# Altium schematic sheet STM32F407ZET6_Core.SchDoc
size A3; SheetNumber: 2; SheetTotal: 4
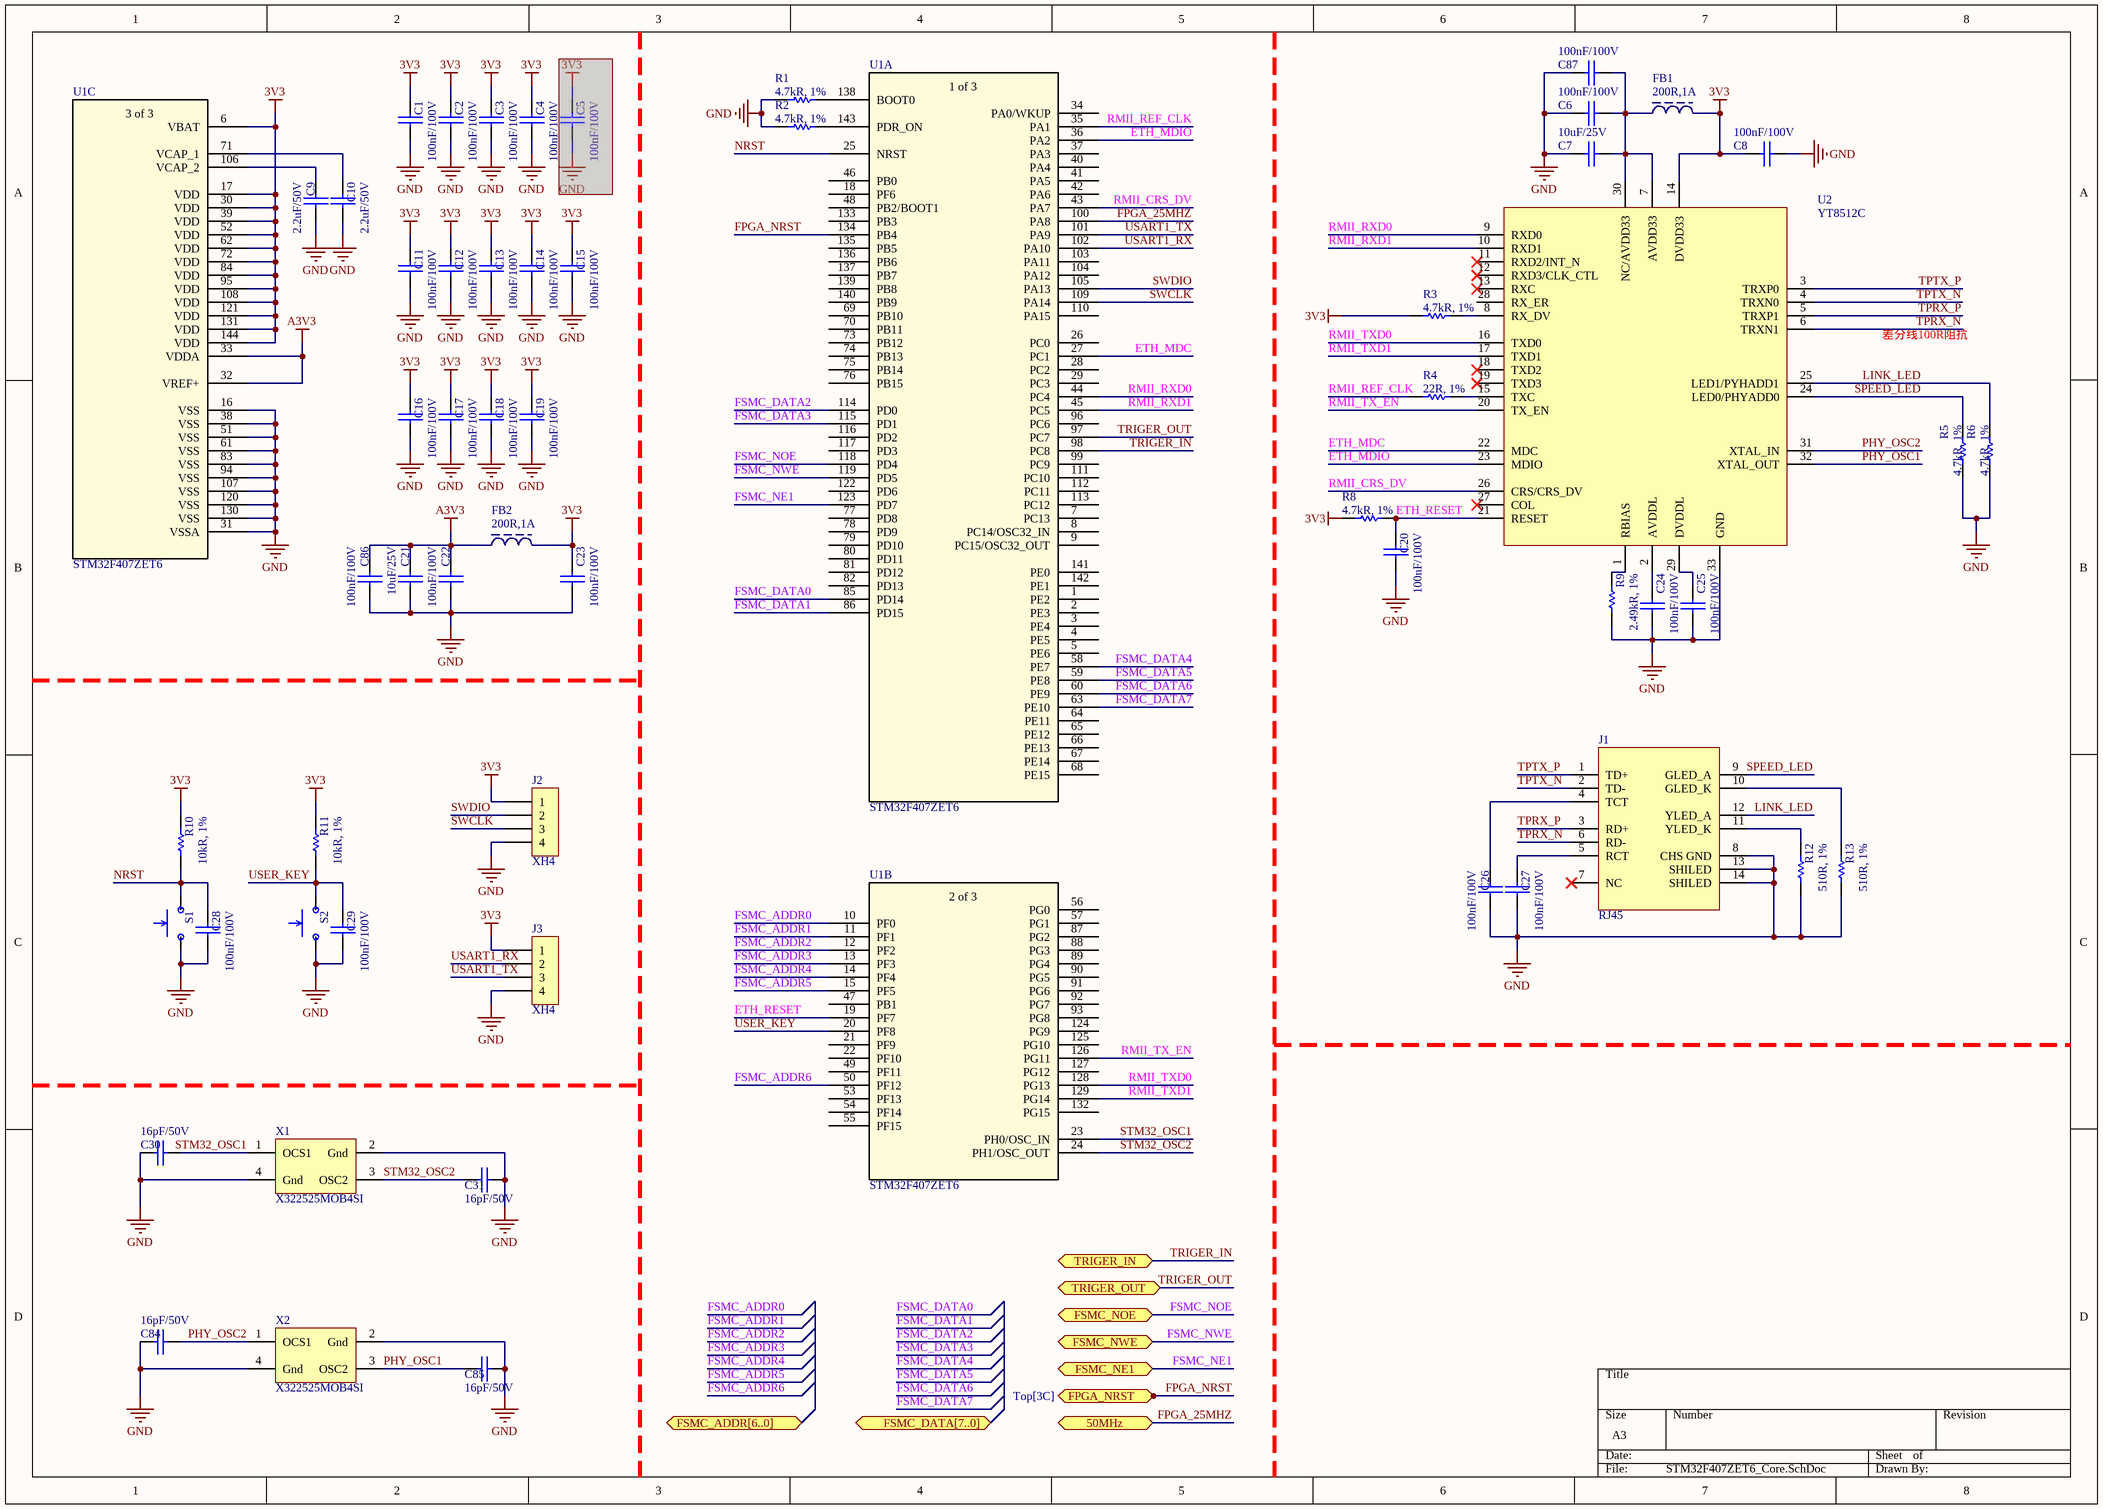
[diagram p0: STM32F407ZET6_Core.SchDoc]

## Parts
C1  100nF/100V  [0603C]
C2  100nF/100V  [0603C]
C3  100nF/100V  [0603C]
C4  100nF/100V  [0603C]
C5  100nF/100V  [0603C]  (masked out: inside a compile mask, not in the netlist)
C6  100nF/100V  [0603C]
C7  10uF/25V  [0603C]
C8  100nF/100V  [0603C]
C9  2.2uF/50V  [0603C]
C10  2.2uF/50V  [0603C]
C11  100nF/100V  [0603C]
C12  100nF/100V  [0603C]
C13  100nF/100V  [0603C]
C14  100nF/100V  [0603C]
C15  100nF/100V  [0603C]
C16  100nF/100V  [0603C]
C17  100nF/100V  [0603C]
C18  100nF/100V  [0603C]
C19  100nF/100V  [0603C]
C20  100nF/100V  [0603C]
C21  10uF/25V  [0603C]
C22  100nF/100V  [0603C]
C23  100nF/100V  [0603C]
C24  100nF/100V  [0603C]
C25  100nF/100V  [0603C]
C26  100nF/100V  [0603C]
C27  100nF/100V  [0603C]
C28  100nF/100V  [0603C]
C29  100nF/100V  [0603C]
C30  16pF/50V  [0603C]
C31  16pF/50V  [0603C]
C84  16pF/50V  [0603C]
C85  16pF/50V  [0603C]
C86  100nF/100V  [0603C]
C87  100nF/100V  [0603C]
FB1  200R,1A  [0603]
FB2  200R,1A  [0603]
J1  RJ45  [1105A_HAN]
J2  XH4  [XH4/2.54mm/180]
J3  XH4  [XH4/2.54mm/180]
R1  4.7kR, 1%  [0603R]
R2  4.7kR, 1%  [0603R]
R3  4.7kR, 1%  [0603R]
R4  22R, 1%  [0603R]
R5  4.7kR, 1%  [0603R]
R6  4.7kR, 1%  [0603R]
R8  4.7kR, 1%  [0603R]
R9  2.49kR, 1%  [0603R]
R10  10kR, 1%  [0603R]
R11  10kR, 1%  [0603R]
R12  510R, 1%  [0603R]
R13  510R, 1%  [0603R]
S1  Key  [SW-SMD]  (value not drawn)
S2  Key  [SW-SMD]  (value not drawn)
U1  STM32F407ZET6  [LQFP144-20x20mm]  (parts A,B,C of 3)
U2  YT8512C  [QFN32]
X1  X322525MOB4SI  [SMD3225-4]
X2  X322525MOB4SI  [SMD3225-4]

## Ports
50MHz (bidir, see Top[3C]), FPGA_NRST (bidir, see Top[3C]), FSMC_ADDR[6..0] (bidir, see Top[3B]), FSMC_DATA[7..0] (bidir, see Top[3B]), FSMC_NE1 (bidir, see Top[3B]), FSMC_NOE (bidir, see Top[3B]), FSMC_NWE (bidir, see Top[3B]), TRIGER_IN (bidir, see Top[3C], EP4CE10F17C8N_Core[6A]), TRIGER_OUT (bidir, see Top[3C], EP4CE10F17C8N_Core[6A])

## Nets
3V3: C1.2 C2.2 C3.2 C4.2 C8.2 C11.2 C12.2 C13.2 C14.2 C15.2 C16.2 C17.2 C18.2 C19.2 C23.2 FB1.2 FB2.2 J2.1 J3.1 R3.1 R8.1 R10.1 R11.1 U1.6(VBAT) U1.17(VDD) U1.30(VDD) U1.39(VDD) U1.52(VDD) U1.62(VDD) U1.72(VDD) U1.84(VDD) U1.95(VDD) U1.108(VDD) U1.121(VDD) U1.131(VDD) U1.144(VDD) U2.14(DVDD33)
A3V3: C21.1 C22.2 C86.2 FB2.1 U1.32(VREF+) U1.33(VDDA)
GND: C1.1 C2.1 C3.1 C4.1 C6.2 C7.2 C8.1 C9.2 C10.2 C11.1 C12.1 C13.1 C14.1 C15.1 C16.1 C17.1 C18.1 C19.1 C20.2 C21.2 C22.1 C23.1 C24.2 C25.2 C26.1 C27.2 C28.1 C29.1 C30.1 C31.2 C84.1 C85.2 C86.1 C87.2 J1.8(CHS_GND) J1.13(SHILED) J1.14(SHILED) J2.4 J3.4 R1.1 R2.1 R5.2 R6.2 R9.1 R12.2 R13.2 S1.1 S2.1 U1.16(VSS) U1.31(VSSA) U1.38(VSS) U1.51(VSS) U1.61(VSS) U1.83(VSS) U1.94(VSS) U1.107(VSS) U1.120(VSS) U1.130(VSS) U2.33(GND) X1.2(Gnd) X1.4(Gnd) X2.2(Gnd) X2.4(Gnd)
ETH_MDC: U1.27(PC1) U2.22(MDC)
ETH_MDIO: U1.36(PA2) U2.23(MDIO)
ETH_RESET: C20.1 R8.2 U1.19(PF7) U2.21(RESET)
FPGA_25MHZ: U1.100(PA8) ; port 50MHz
FPGA_NRST: U1.134(PB4) ; port FPGA_NRST
FSMC_ADDR0: U1.10(PF0)
FSMC_ADDR1: U1.11(PF1)
FSMC_ADDR2: U1.12(PF2)
FSMC_ADDR3: U1.13(PF3)
FSMC_ADDR4: U1.14(PF4)
FSMC_ADDR5: U1.15(PF5)
FSMC_ADDR6: U1.50(PF12)
FSMC_DATA0: U1.85(PD14)
FSMC_DATA1: U1.86(PD15)
FSMC_DATA2: U1.114(PD0)
FSMC_DATA3: U1.115(PD1)
FSMC_DATA4: U1.58(PE7)
FSMC_DATA5: U1.59(PE8)
FSMC_DATA6: U1.60(PE9)
FSMC_DATA7: U1.63(PE10)
FSMC_NE1: U1.123(PD7) ; port FSMC_NE1
FSMC_NOE: U1.118(PD4) ; port FSMC_NOE
FSMC_NWE: U1.119(PD5) ; port FSMC_NWE
LINK_LED: J1.12(YLED_A) R6.1 U2.25(LED1/PYHADD1)
NRST: C28.2 R10.2 S1.2 U1.25(NRST)
PHY_OSC1: C85.1 U2.32(XTAL_OUT) X2.3(OSC2)
PHY_OSC2: C84.2 U2.31(XTAL_IN) X2.1(OCS1)
RMII_CRS_DV: U1.43(PA7) U2.26(CRS/CRS_DV)
RMII_REF_CLK: R4.1 U1.35(PA1)
RMII_RXD0: U1.44(PC4) U2.9(RXD0)
RMII_RXD1: U1.45(PC5) U2.10(RXD1)
RMII_TX_EN: U1.126(PG11) U2.20(TX_EN)
RMII_TXD0: U1.128(PG13) U2.16(TXD0)
RMII_TXD1: U1.129(PG14) U2.17(TXD1)
SPEED_LED: J1.9(GLED_A) R5.1 U2.24(LED0/PHYADD0)
STM32_OSC1: C30.2 U1.23(PH0/OSC_IN) X1.1(OCS1)
STM32_OSC2: C31.1 U1.24(PH1/OSC_OUT) X1.3(OSC2)
SWCLK: J2.3 U1.109(PA14)
SWDIO: J2.2 U1.105(PA13)
TPRX_N: J1.6(RD-) U2.6(TRXN1)
TPRX_P: J1.3(RD+) U2.5(TRXP1)
TPTX_N: J1.2(TD-) U2.4(TRXN0)
TPTX_P: J1.1(TD+) U2.3(TRXP0)
TRIGER_IN: U1.98(PC8) ; port TRIGER_IN
TRIGER_OUT: U1.97(PC7) ; port TRIGER_OUT
USART1_RX: J3.2 U1.102(PA10)
USART1_TX: J3.3 U1.101(PA9)
USER_KEY: C29.2 R11.2 S2.2 U1.20(PF8)
NetC6_1: C6.1 C7.1 C87.1 FB1.1 U2.7(AVDD33) U2.30(NC/AVDD33)
NetC9_1: C9.1 U1.106(VCAP_2)
NetC10_1: C10.1 U1.71(VCAP_1)
NetC24_1: C24.1 U2.2(AVDDL)
NetC25_1: C25.1 U2.29(DVDDL)
NetC26_2: C26.2 J1.4(TCT)
NetC27_1: C27.1 J1.5(RCT)
NetJ1_10: J1.10(GLED_K) R13.1
NetJ1_11: J1.11(YLED_K) R12.1
NetR1_2: R1.2 U1.138(BOOT0)
NetR2_2: R2.2 U1.143(PDR_ON)
NetR3_2: R3.2 U2.8(RX_DV)
NetR4_2: R4.2 U2.15(TXC)
NetR9_2: R9.2 U2.1(RBIAS)

Not connected (* = marked no-connect by the designer): J1 7(NC)*; U1 1(PE2) 2(PE3) 3(PE4) 4(PE5) 5(PE6) 7(PC13) 8(PC14/OSC32_IN) 9(PC15/OSC32_OUT) 18(PF6) 21(PF9) 22(PF10) 26(PC0) 28(PC2) 29(PC3) 34(PA0/WKUP) 37(PA3) 40(PA4) 41(PA5) 42(PA6) 46(PB0) 47(PB1) 48(PB2/BOOT1) 49(PF11) 53(PF13) 54(PF14) 55(PF15) 56(PG0) 57(PG1) 64(PE11) 65(PE12) 66(PE13) 67(PE14) 68(PE15) 69(PB10) 70(PB11) 73(PB12) 74(PB13) 75(PB14) 76(PB15) 77(PD8) 78(PD9) 79(PD10) 80(PD11) 81(PD12) 82(PD13) 87(PG2) 88(PG3) 89(PG4) 90(PG5) 91(PG6) 92(PG7) 93(PG8) 96(PC6) 99(PC9) 103(PA11) 104(PA12) 110(PA15) 111(PC10) 112(PC11) 113(PC12) 116(PD2) 117(PD3) 122(PD6) 124(PG9) 125(PG10) 127(PG12) 132(PG15) 133(PB3) 135(PB5) 136(PB6) 137(PB7) 139(PB8) 140(PB9) 141(PE0) 142(PE1); U2 11(RXD2/INT_N)* 12(RXD3/CLK_CTL)* 13(RXC)* 18(TXD2)* 19(TXD3)* 27(COL)* 28(RX_ER)

## Notes on the sheet
- 差分线100R阻抗
- (in symbol STM32F407ZET6, part A) 1 of 3
- (in symbol STM32F407ZET6, part B) 2 of 3
- (in symbol STM32F407ZET6, part C) 3 of 3

## Library data of the parts
C1-C6 C8 C11-C20 C22-C29 C86 C87 = CAP: CC0603KRX7R9BB104
C7 C21 = CAP: CC0603MRX5R8BB106
C9 C10 = CAP: CC0603KRX5R9BB225
C30 C31 C84 C85 = CAP: CC0603FRNPO9BN160
FB1 FB2 = 磁珠_1: PZ1608D201-1R0TF
J1 = RJ45: HR911105A HANREN
J2 J3 = XH4: ZX-XH2.54-4PZZ
R1-R3 R5 R6 R8 = RES: RC0603FR-074K7L
R4 = RES: RC0603FR-0722RL
R9 = RES: RC0603FR-072K49L
R10 R11 = RES: AC0603FR-0710KL
R12 R13 = RES: RC0603FR-07510RL
S1 S2 = SW: TS-1101-C-W
U1 = STM32F407ZET6: High-performance foundation line, Arm Cortex-M4 core with DSP and FPU, 512 Kbytes of Flash memory, 168 MHz CPU, ART Accelerator, Ethernet, FSMC; Manufacturer_Name: STMicroelectronics; Copyright: Copyright (C) 2025 Ultra Librarian. All rights reserved.; Manufacturer_Part_Number: STM32F407ZET6; Datasheet: https://www.st.com/resource/en/datasheet/stm32f405rg.pdf; RefDes: RefDes; Type: Type
U2 = YT8512C: PHY
X1 X2 = DSX321G-16M: 无源晶振